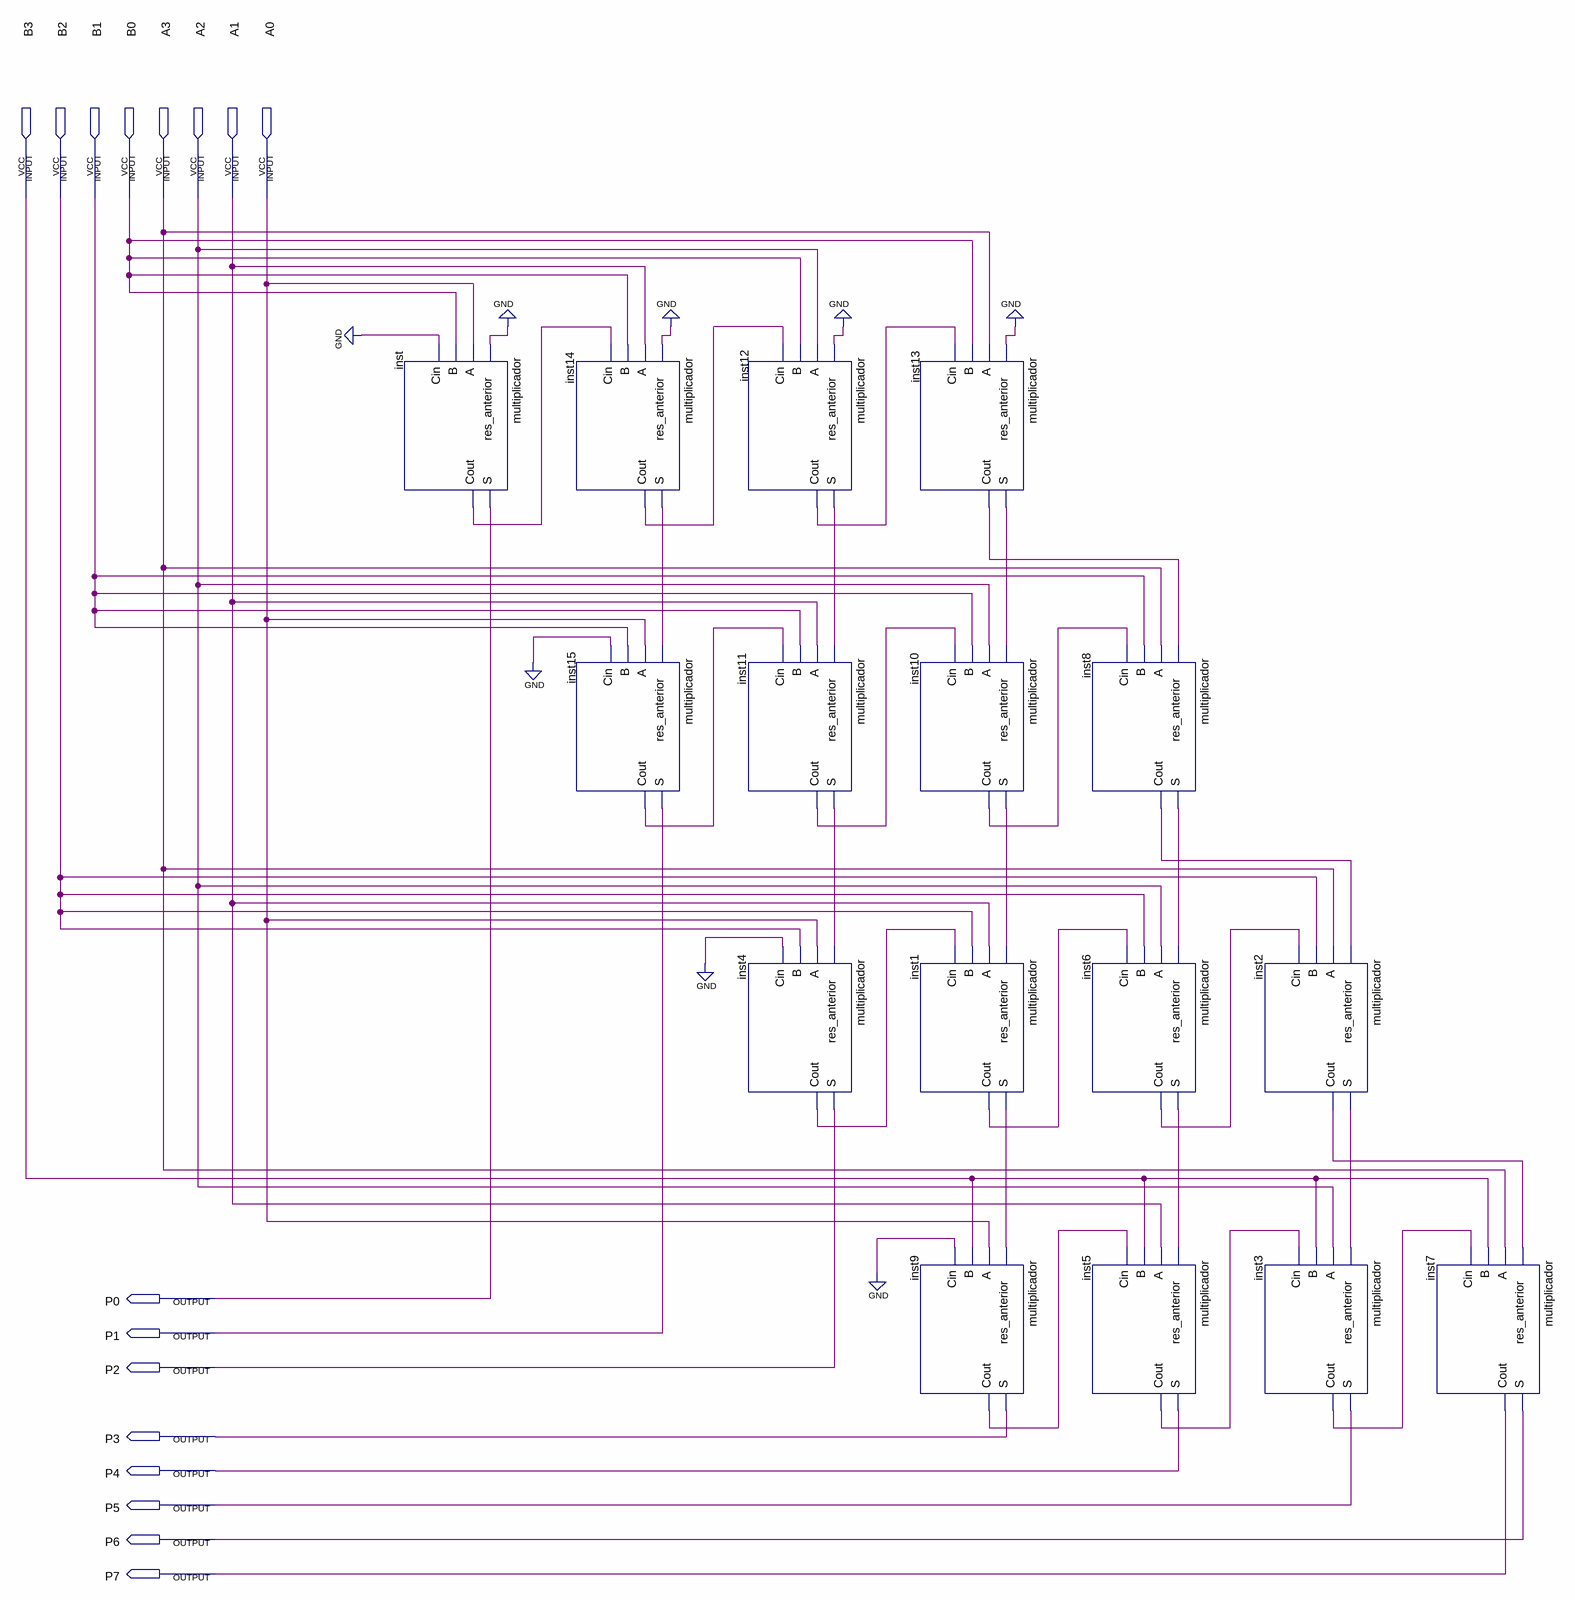
[diagram p0: schematic sheet]
// Quartus schematic proj-11-multiplicador.bdf as structural Verilog: 16 symbols, 16 pins
module \proj-11-multiplicador  (
  input  B3,
  input  B2,
  input  B1,
  input  B0,
  input  A3,
  input  A2,
  input  A1,
  input  A0,
  output P0,
  output P1,
  output P2,
  output P3,
  output P4,
  output P5,
  output P6,
  output P7
);

  wire inst1_cout, inst1_s, inst2_cout, inst2_s, inst3_cout, inst4_cout, inst5_cout, inst6_cout, inst6_s,
       inst8_cout, inst8_s, inst9_cout, inst10_cout, inst10_s, inst11_cout, inst11_s, inst12_cout, inst12_s,
       inst13_cout, inst13_s, inst14_cout, inst14_s, inst15_cout, inst_cout;

  multiplicador inst (.res_anterior(1'b0), .A(A0), .B(B0), .Cin(1'b0), .S(P0), .Cout(inst_cout));
  multiplicador inst14 (.res_anterior(1'b0), .A(A1), .B(B0), .Cin(inst_cout), .S(inst14_s), .Cout(inst14_cout));
  multiplicador inst15 (.res_anterior(inst14_s), .A(A0), .B(B1), .Cin(1'b0), .S(P1), .Cout(inst15_cout));
  multiplicador inst12 (.res_anterior(1'b0), .A(A2), .B(B0), .Cin(inst14_cout), .S(inst12_s), .Cout(inst12_cout));
  multiplicador inst11 (.res_anterior(inst12_s), .A(A1), .B(B1), .Cin(inst15_cout), .S(inst11_s), .Cout(inst11_cout));
  multiplicador inst4 (.res_anterior(inst11_s), .A(A0), .B(B2), .Cin(1'b0), .S(P2), .Cout(inst4_cout));
  multiplicador inst13 (.res_anterior(1'b0), .A(A3), .B(B0), .Cin(inst12_cout), .S(inst13_s), .Cout(inst13_cout));
  multiplicador inst10 (.res_anterior(inst13_s), .A(A2), .B(B1), .Cin(inst11_cout), .S(inst10_s), .Cout(inst10_cout));
  multiplicador inst1 (.res_anterior(inst10_s), .A(A1), .B(B2), .Cin(inst4_cout), .S(inst1_s), .Cout(inst1_cout));
  multiplicador inst9 (.res_anterior(inst1_s), .A(A0), .B(B3), .Cin(1'b0), .S(P3), .Cout(inst9_cout));
  multiplicador inst8 (.res_anterior(inst13_cout), .A(A3), .B(B1), .Cin(inst10_cout), .S(inst8_s), .Cout(inst8_cout));
  multiplicador inst6 (.res_anterior(inst8_s), .A(A2), .B(B2), .Cin(inst1_cout), .S(inst6_s), .Cout(inst6_cout));
  multiplicador inst5 (.res_anterior(inst6_s), .A(A1), .B(B3), .Cin(inst9_cout), .S(P4), .Cout(inst5_cout));
  multiplicador inst2 (.res_anterior(inst8_cout), .A(A3), .B(B2), .Cin(inst6_cout), .S(inst2_s), .Cout(inst2_cout));
  multiplicador inst3 (.res_anterior(inst2_s), .A(A2), .B(B3), .Cin(inst5_cout), .S(P5), .Cout(inst3_cout));
  multiplicador inst7 (.res_anterior(inst2_cout), .A(A3), .B(B3), .Cin(inst3_cout), .S(P6), .Cout(P7));
endmodule
